# Altium project Generador de Funciones.PrjPcb
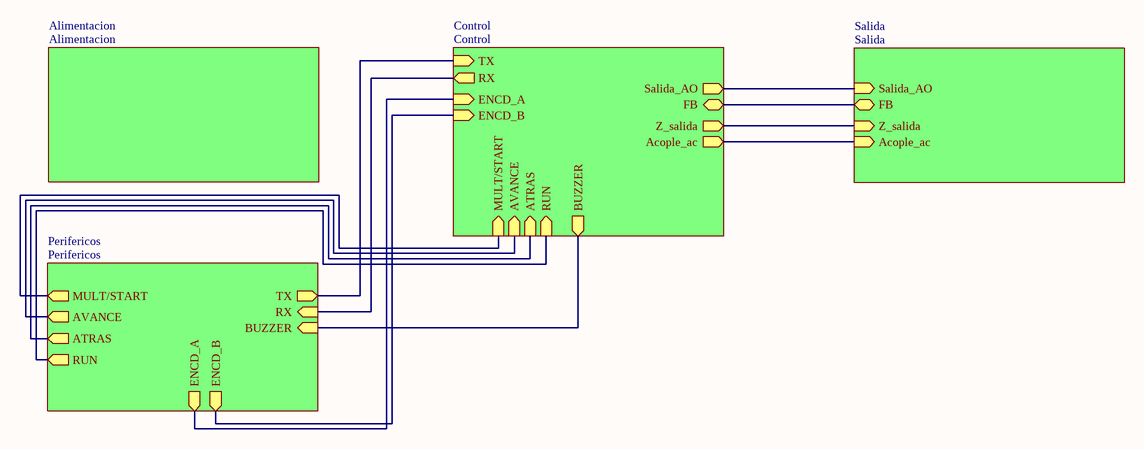
[diagram p0: main.SchDoc]
6 sheets, 107 parts. Net scope: hierarchical (ports join the sheet entries above them; power ports are global).
Board file: PCB_Awg.PcbDoc
Sheets:
  main.SchDoc
    Alimentacion = Alimentacion.SchDoc
    Control = Control.SchDoc
      Dac = 2-R2 Dac.SchDoc
    Salida = Salida.SchDoc
    Perifericos = Perifericos.SchDoc

## Sheet main.SchDoc: Generador de Funciones
size A4; Author: Zuliani, Agustin; Revision: v1.0; SheetNumber: 1; SheetTotal: 6

### Sub-sheets
Alimentacion = Alimentacion: no entries
Control = Control: TX (in), AVANCE (in), BUZZER (out), RUN (in), ENCD_B (in), MULT/START (in), Salida_AO (out), ATRAS (in), RX (out), Z_salida (out), Acople_ac (out), ENCD_A (in), FB (bidir)
Perifericos = Perifericos: BUZZER (in), ENCD_A (out), MULT/START (out), AVANCE (out), ATRAS (out), RUN (out), TX (out), RX (in), ENCD_B (out)
Salida = Salida: Salida_AO (in), Acople_ac (in), FB (bidir), Z_salida (in)

### Nets
ATRAS: sheet Control/ATRAS, sheet Perifericos/ATRAS
AVANCE: sheet Control/AVANCE, sheet Perifericos/AVANCE
MULT/START: sheet Control/MULT/START, sheet Perifericos/MULT/START
RUN: sheet Control/RUN, sheet Perifericos/RUN
RX: sheet Control/RX, sheet Perifericos/RX
TX: sheet Control/TX, sheet Perifericos/TX
NetC18_1: sheet Control/FB, sheet Salida/FB
NetP1_1: sheet Control/Salida_AO, sheet Salida/Salida_AO
NetP3_1: sheet Control/ENCD_A, sheet Perifericos/ENCD_A
NetP3_3: sheet Control/ENCD_B, sheet Perifericos/ENCD_B
NetR19_2: sheet Control/Acople_ac, sheet Salida/Acople_ac
NetR20_2: sheet Control/Z_salida, sheet Salida/Z_salida
NetR30_1: sheet Control/BUZZER, sheet Perifericos/BUZZER

## Sheet Alimentacion.SchDoc
size A3; SheetNumber: 2; SheetTotal: 6
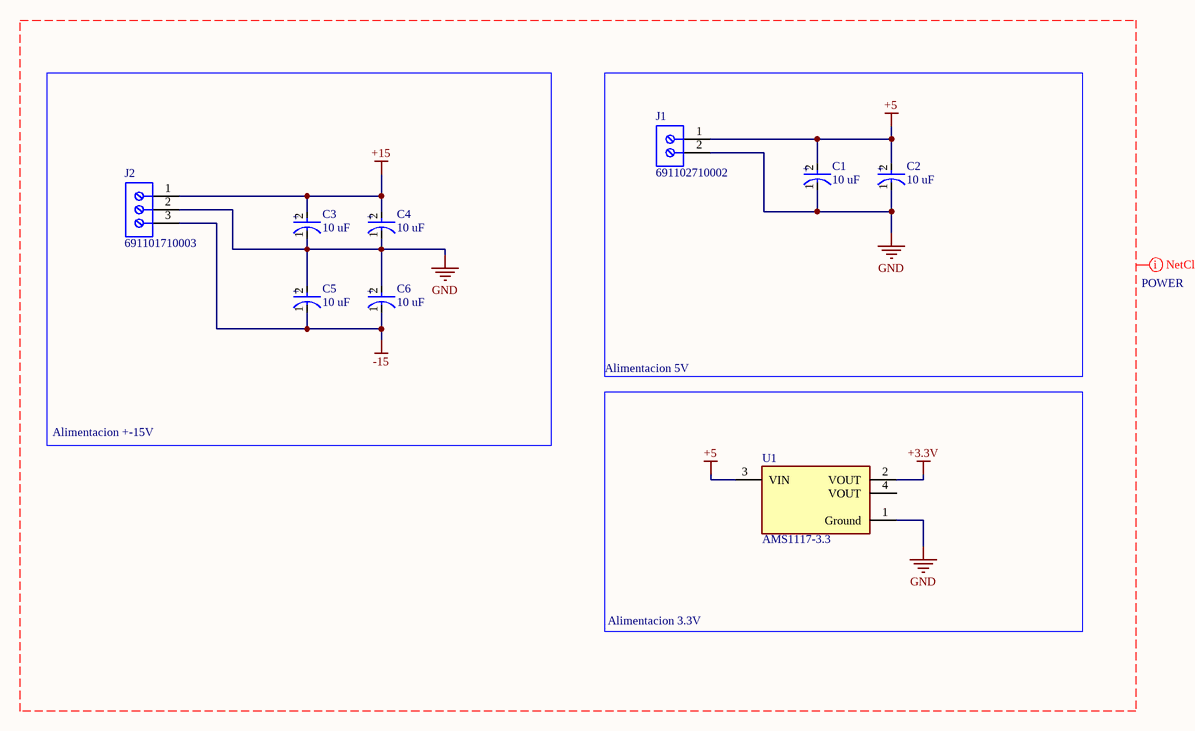
[diagram p1: Alimentacion.SchDoc]

### Parts
C1  10 uF  [FP-RAD-TH-D_5_0_5-L_11_1-MFG]
C2  10 uF  [FP-RAD-TH-D_5_0_5-L_11_1-MFG]
C3  10 uF  [FP-RAD-TH-D_5_0_5-L_11_1-MFG]
C4  10 uF  [FP-RAD-TH-D_5_0_5-L_11_1-MFG]
C5  10 uF  [FP-RAD-TH-D_5_0_5-L_11_1-MFG]
C6  10 uF  [FP-RAD-TH-D_5_0_5-L_11_1-MFG]
J1  691102710002  [691102710002]
J2  691101710003  [691101710003]
U1  AMS1117-3.3  [FP-AMS1117-IPC_C]

### Blocks framed on the sheet
Alimentacion +-15V: C3-C6 J2
Alimentacion 5V: C1 C2 J1

### Nets
+3.3V: U1.2(VOUT)
+5: C1.2(A) C2.2(A) J1.1 U1.3(VIN)
+15: C3.2(A) C4.2(A) J2.1
-15: C5.1(C) C6.1(C) J2.3
GND: C1.1(C) C2.1(C) C3.1(C) C4.1(C) C5.2(A) C6.2(A) J1.2 J2.2 U1.1(Ground)

Not connected (* = marked no-connect by the designer): U1 4(VOUT)

### Layout directives
net class POWER; rule Width Constraint [Pref Width = 0.5mm    Min Width = 0.5mm    Max Width = 1mm]: +3.3V, +5, +15, -15, GND

### Notes on the sheet
- Alimentacion 3.3V
- (in symbol CMP-05427-001517-1) +

### Library data of the parts
C1-C6 = CMP-05427-001517-1: Aluminum Electrolytic Capacitors (Radial Lead Type) 10uF ±20% 63V; Life (Hours): 2000Hour; Dielectric Material: Aluminium; Lead/Base Style: Straight; Ripple Current: 70mA; Dissipation Factor: 0.11%; Leakage Current: 3uA; Lead Diameter: 0.5mm; Max Operating Temperature: 85°C; Capacitance: 10uF; Voltage Rating: 63V; Packaging: Bulk; Radiation Hardening: No; Tolerance: 20%; Height: 11mm; Mount: Through Hole; Voltage: 63V; Voltage Rating (DC): 63V; Lead Pitch: 2mm; RoHS Compliant: Yes; Diameter: 5mm; Package Quantity: 200; Length: 11mm; Case/Package: Radial; Min Operating Temperature: -40°C; Construction: RADIAL; Height - Seated (Max): 0.472inch; Lead Free: Lead Free; Termination: Radial; Width: 5mm; Series: M; REACH SVHC: No SVHC
J1 = CMP-1502-03258-2: NexarPartId: 8917706; Number of Levels: 1; Number of Positions Per Level: 2; Current: 15A; Voltage: 300V; Pitch: 5.0038mm; Plating: Steel; Stripping Length: -6mm; Wire Gauge (Min): 14AWG; Wire Gauge (Max): 22AWG; Length: 7.5mm; Contact Material: Brass; Contact Plating: Tin; Packaging: Box; Number of Pins: 2; Voltage Rating: 300V; Termination: Screw; Number of Contacts: 2; Color: Blue; Current Rating: 15A; Mount: Through Hole; Max Operating Temperature: 105°C; Min Operating Temperature: -40°C; REACH SVHC: Unknown; Height: 13.4mm; Width: 11.2mm; Housing Material: Nylon; RoHS: Compliant; Wire/Cable Gauge: 22AWG; Lead Pitch: 5mm
J2 = CMP-1502-03257-2: NexarPartId: 8917705; Voltage Rating: 250V; Current: 16A; Wire Gauge (Min): 14AWG; Pitch: 5.0038mm; Wire Gauge (Max): 26AWG; Number of Positions Per Level: 3; Plating: Steel; Number of Levels: 1; Stripping Length: -7mm; REACH SVHC: Unknown; Width: 16.2mm; Height: 16.4mm; Contact Material: Brass; RoHS: Compliant; Color: Blue; Contact Plating: Tin; Lead Pitch: 5mm; Packaging: Box; Termination: Screw; Number of Contacts: 3; Wire/Cable Gauge: 26AWG; Min Operating Temperature: -40°C; Max Operating Temperature: 105°C; Housing Material: Nylon; Length: 9mm; Voltage: 250V; Mount: Through Hole; Current Rating: 16A; Number of Pins: 3
U1 = CMP-209535-000001-1: LDO Voltage Regulators 1A, 3.3V; Manufacturer: Advanced Monolithic Systems; Dropout Voltage: 1.1V; Output Type: Fixed; Nominal Supply Current: 5mA; Max Power Dissipation: 1.2W; Max Supply Voltage: 15V; Number Of Outputs: 1; Standoff Height: 0.64mm; Max Junction Temp: +125°C; Height: 1.8mm; Package: AMS1117; Device Class L2: Power Management ICs; ComponentLink2Description: Datasheet; ComponentLink2URL: http://www.advanced-monolithic.com/pdf/ds1117.pdf; Category: IC; RoHS: TRUE; Automotive: No; Device Class L1: Integrated Circuits (ICs); Output Current: 1A; Device Class L3: Voltage Regulators - Linear; Temperature: -40°C to +125°C; Output Voltage: 3.3V; Manufacturer Part Number: AMS1117-3.3; Temperature Range Low: -40°C; Octopart: https://octopart.com/ams1117-3.3-advanced+monolithic+systems-25899300; Lead Free: Yes; Ipc Land Pattern Name: SOT229P700X180-4; Temperature Range High: +125°C

## Sheet Control.SchDoc: Control
size A4; SheetNumber: 3; SheetTotal: 6
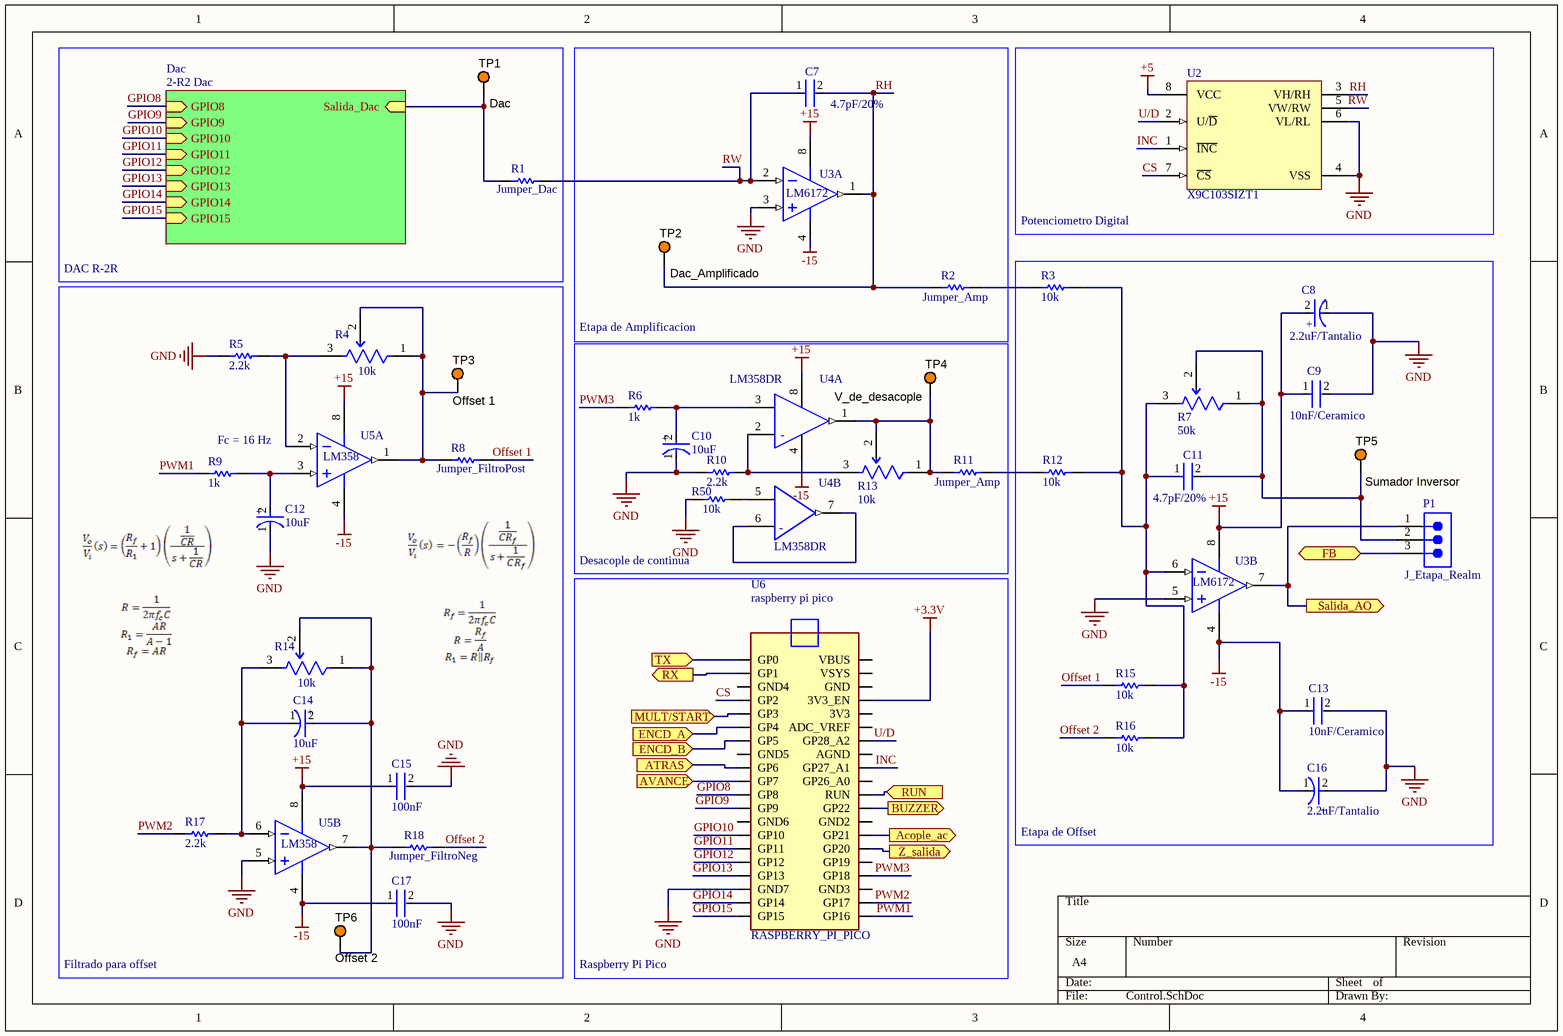
[diagram p2: Control.SchDoc]

### Parts
C7  4.7pF/20%  [FP-0805-L_2_01_0_2-W_1_25-IPC_B]
C8  2.2uF/Tantalio  [FP-T491A225K010AT-MFG]
C9  10nF/Ceramico  [FP-0805-L_2_01_0_2-W_1_25-IPC_B]
C10  10uF  [FP-RAD-TH-D_5_0_5-L_11_1-MFG]
C11  4.7pF/20%  [FP-0805-L_2_01_0_2-W_1_25-IPC_B]
C12  10uF  [FP-RAD-TH-D_5_0_5-L_11_1-MFG]
C13  10nF/Ceramico  [FP-0805-L_2_01_0_2-W_1_25-IPC_B]
C14  10uF  [FP-RAD-TH-D_5_0_5-L_11_1-MFG]
C15  100nF  [FP-0805-L_2_01_0_2-W_1_25-IPC_B]
C16  2.2uF/Tantalio  [FP-T491A225K010AT-MFG]
C17  100nF  [FP-0805-L_2_01_0_2-W_1_25-IPC_B]
P1  J_Etapa_Realm  [61300311121]
R1  Jumper_Dac  [RESC2013X50X30LL20T20]
R2  Jumper_Amp  [RESC2013X50X30LL20T20]
R3  10k  [RESC2013X50X30LL20T20]
R4  10k  [FP-3296W-MFG]
R5  2.2k  [RESC2013X50X30LL20T20]
R6  1k  [RESC2013X50X30LL20T20]
R7  50k  [FP-3296W-MFG]
R8  Jumper_FiltroPost  [RESC2013X50X30LL20T20]
R9  1k  [RESC2013X50X30LL20T20]
R10  2.2k  [RESC2013X50X30LL20T20]
R11  Jumper_Amp  [RESC2013X50X30LL20T20]
R12  10k  [RESC2013X50X30LL20T20]
R13  10k  [FP-3296W-MFG]
R14  10k  [FP-3296W-MFG]
R15  10k  [RESC2013X50X30LL20T20]
R16  10k  [RESC2013X50X30LL20T20]
R17  2.2k  [RESC2013X50X30LL20T20]
R18  Jumper_FiltroNeg  [RESC2013X50X30LL20T20]
R50  10k  [RESC2013X50X30LL20T20]
TP1  Dac  [KSTN-5003]
TP2  Dac_Amplificado  [KSTN-5003]
TP3  Offset 1  [KSTN-5003]
TP4  V_de_desacople  [KSTN-5003]
TP5  Sumador Inversor  [KSTN-5003]
TP6  Offset 2  [KSTN-5003]
U2  X9C103SIZT1  [M8_15_MFG]
U3  LM6172  [D0008A_N]  (parts A,B of 2)
U4  LM358DR  [FP-D0008A-MFG]  (parts A,B of 2)
U5  LM358  [ONSC-SOIC-8-751-07_V]  (parts A,B of 2)
U6  RASPBERRY_PI_PICO  [RASPBERRY_PI_PICO]

### Blocks framed on the sheet
DAC R-2R: R1 TP1
Etapa de Amplificacion: C7 R2 TP2 U3
Potenciometro Digital: U2
Etapa de Offset: C8 C9 C11 C13 C16 P1 R3 R7 R12 R15 R16 TP5 U3

### Sub-sheets
Dac = 2-R2 Dac: GPIO14 (in), GPIO9 (in), GPIO13 (in), GPIO8 (in), Salida_Dac (in), GPIO10 (in), GPIO11 (in), GPIO12 (in), GPIO15 (in)

### Ports
Acople_ac (out), ATRAS (in), AVANCE (in), BUZZER (out), ENCD_A (in), ENCD_B (in), FB (bidir), MULT/START (in), RUN (in), RX (out), Salida_AO (out), TX (in), Z_salida (out)

### Nets
+3.3V: U6.3V3_EN
+5: U2.8(VCC)
+15: C8.2(A) C9.1 C15.1 U3.8(V+) U4.8(V+) U5.8(VCC)
-15: C13.1 C16.1(C) C17.1 U3.4(V-) U4.4(V-) U5.4(VEE/GND)
GND: C8.1(C) C9.2 C10.1(C) C12.1(C) C13.2 C15.2 C16.2(A) C17.2 R5.1 R10.1 R50.1 U2.4(VSS) U2.6(VL/RL) U3.3(INA+) U3.5(INB+) U5.5(INB+) U6.GND7
ATRAS: U6.GP6 ; port ATRAS
AVANCE: U6.GP7 ; port AVANCE
CS: U2.7(~{CS}) U6.GP2
GPIO8: U6.GP8 ; sheet Dac/GPIO8
GPIO9: U6.GP9 ; sheet Dac/GPIO9
GPIO10: U6.GP10 ; sheet Dac/GPIO10
GPIO11: U6.GP11 ; sheet Dac/GPIO11
GPIO12: U6.GP12 ; sheet Dac/GPIO12
GPIO13: U6.GP13 ; sheet Dac/GPIO13
GPIO14: U6.GP14 ; sheet Dac/GPIO14
GPIO15: U6.GP15 ; sheet Dac/GPIO15
INC: U2.1(~{INC}) U6.GP27_A1
MULT/START: U6.GP3 ; port MULT/START
Offset 1: R8.2 R15.1
Offset 2: R16.1 R18.2
PWM1: R9.1 U6.GP16
PWM2: R17.1 U6.GP17
PWM3: R6.1 U6.GP18
RH: C7.2 R2.1 TP2.1 U2.3(VH/RH) U3.1(OUTA)
RUN: U6.RUN ; port RUN
RW: C7.1 R1.2 U2.5(VW/RW) U3.2(INA-)
RX: U6.GP1 ; port RX
Salida_Dac: R1.1 TP1.1 ; sheet Dac/Salida_Dac
TX: U6.GP0 ; port TX
U/D: U2.2(U/~{D}) U6.GP28_A2
NetC10_2: C10.2(A) R6.2 U4.3(IN1+)
NetC11_1: C11.1 R3.2 R7.3(CW) R12.2 R15.2 R16.2 U3.6(INB-)
NetC11_2: C11.2 P1.2 R7.1(CCW) R7.2(WIPER) TP5.1
NetC12_2: C12.2(A) R9.2 U5.3(INA+)
NetC14_1: C14.1(C) R14.3(CW) R17.2 U5.6(INB-)
NetC14_2: C14.2(A) R14.1(CCW) R14.2(WIPER) R18.1 TP6.1 U5.7(OUTB)
NetC18_1: P1.3 ; port FB
NetP1_1: P1.1 U3.7(OUTB) ; port Salida_AO
NetP3_1: U6.GP4 ; port ENCD_A
NetP3_3: U6.GP5 ; port ENCD_B
NetR2_2: R2.2 R3.1
NetR4_1: R4.1(CCW) R4.2(WIPER) R8.1 TP3.1 U5.1(OUTA)
NetR4_3: R4.3(CW) R5.2 U5.2(INA-)
NetR10_2: R10.2 R13.3(CW) U4.2(IN1-)
NetR11_1: R11.1 R13.1(CCW) R13.2(WIPER) TP4.1 U4.1(1OUT)
NetR11_2: R11.2 R12.1
NetR19_2: U6.GP21 ; port Acople_ac
NetR20_2: U6.GP20 ; port Z_salida
NetR30_1: U6.GP22 ; port BUZZER
NetR50_2: R50.2 U4.5(IN2+)
NetU4_6: U4.6(IN2-) U4.7(2OUT)

Not connected (* = marked no-connect by the designer): U6 3V3 ADC_VREF AGND GND GND2 GND3 GND4 GND5 GND6 GP19 GP26_A0 VBUS VSYS

### Notes on the sheet
- Fc = 16 Hz
- Desacople de continua
- Filtrado para offset
- Raspberry Pi Pico
- (in symbol CMP-1685-00009-2, part A) -
- (in symbol CMP-1685-00009-2, part B) -
- (in symbol CMP-03017-000061-1) +
- (in symbol CMP-05427-001517-1) +
- (in symbol RASPBERRY_PI_PICO) raspberry pi pico

### Library data of the parts
C7 C9 C11 C13 C15 C17 = CMP-2007-04174-2: General Purpose Ceramic Capacitor, 0805, 100nF, 10%, X7R, 15%, 100V; Packaging: Tape and Reel; Min Operating Temperature: -55°C; Dielectric Material: Ceramic; Height: 1.4mm; Voltage Rating: 100V; Termination: SMD/SMT; Case Code (Imperial): 0805; Case Code (Metric): 2012; Case/Package: 0805; Construction: Flat; Radiation Hardening: No; Series: -; Dielectric: X7R; Package Quantity: 2000; Mount: Surface Mount; Capacitance: 100nF; Contact Plating: Tin; Voltage: 100V; Lead Free: Lead Free; Depth: 1.25mm; RoHS Compliant: Yes; Number of Pins: 2; Max Operating Temperature: 125°C; Length: 2.01mm; Voltage Rating (DC): 100V; Thickness: 0.055inch; REACH SVHC: No SVHC; Width: 0.049inch; Tolerance: 10%
C8 C16 = CMP-03017-000061-1: CAP TANT 2.2UF 10% 10V 1206; Polarity: Polar; Dissipation Factor: 6%; ESR (Equivalent Series Resistance): 8R; Ripple Current: 97mA; Dielectric Material: Tantalum; Life (Hours): 2000Hour; Leakage Current: 500nA; Max Operating Temperature: 125°C; Length: 3.2mm; Tolerance: 10%; RoHS Compliant: Yes; Packaging: Tape and Reel; Package Quantity: 1; Voltage: 10V; Voltage Rating: 10V; Height - Seated (Max): 0.071inch; Width: 1.6mm; Voltage Rating (DC): 10V; REACH SVHC: No SVHC; Lead Free: Lead Free; Features: General Purpose; Termination: SMD/SMT; Height: 1.6mm; Depth: 1.6mm; Min Operating Temperature: -55°C; Radiation Hardening: No; Mount: Surface Mount; Capacitance: 2.2uF; Case Code (Metric): 3216; Case/Package: 1206; Case Code (Imperial): 1206; Number of Pins: 2
C10 C12 C14 = CMP-05427-001517-1: as C1 on sheet Alimentacion; Max Operating Temperature: 85°C; Capacitance: 10uF; Voltage Rating: 63V; Packaging: Bulk; Radiation Hardening: No; Tolerance: 20%; Height: 11mm; Mount: Through Hole; Voltage: 63V; Voltage Rating (DC): 63V; Lead Pitch: 2mm; RoHS Compliant: Yes; Diameter: 5mm; Package Quantity: 200; Length: 11mm; Case/Package: Radial; Min Operating Temperature: -40°C; Construction: RADIAL; Height - Seated (Max): 0.472inch; Lead Free: Lead Free; Termination: Radial; Width: 5mm; Series: M; REACH SVHC: No SVHC
P1 = CMP-1502-01062-3: NexarPartId: 32855521; Current Rating: 3A; Voltage Rating: 250V; Number of Positions: 3; Pitch: 2.54mm; Contact Resistance: 20mΩ; Connector Type: Male Pin; Gender: Male; REACH SVHC: Unknown; Packaging: Bulk; Contact Material: Copper; Min Operating Temperature: -40°C; Number of Rows: 1; Orientation: Vertical; RoHS: Compliant; Contact Plating: Gold; Max Operating Temperature: 105°C; Mount: Through Hole; Height: 8.94mm; Operating Supply Voltage: 250V; Number of Pins: 3; Contact Mating Length: 5.9944mm; Number of Contacts: 3; Color: Black; Lead Free: Lead Free; Lead Pitch: 2.54mm; Termination: Solder
R1-R3 R5 R6 R8-R12 R15-R18 R50 = CMP-2001-04896-1: Manufacturer: Vishay Dale; Part Number: CRCW08050000Z0EA
R4 R7 R13 R14 = CMP-07234-000046-1: TRIMMER 500 OHM 0.5W PC PIN TOP; Resistance: 500R; Temperature Coefficient: 100ppm/°C; Resistance Tolerance: 10%; Number of Turns: 25; Max Power Dissipation: 500mW; Packaging: Rail/Tube; Color: Blue; Technology: CERMET; Max Operating Temperature: 125°C; RoHS Compliant: Yes; Radiation Hardening: No; Series: 3296; Military Standard: Not; Width: 9.53mm; Weight: 0.03oz; Length: 9.53mm; Package Quantity: 50; Height: 0.395inch; Min Operating Temperature: -55°C; Lead Free: Lead Free; Mount: Through Hole; Depth: 4.83mm; Termination: Pin; Taper: Linear; Contact Plating: Tin; Resistor Type: Cermet; Tolerance: 10%; REACH SVHC: No SVHC; Power Rating: 500mW
TP1-TP6 = CMP-1672-00009-1: Test Point, Orange, 1-Pin THD, RoHS; Peak Reverse Current: 600 uA; Forward Current: 3 A; Max Surge Current: 80 A; Forward Voltage: 1.08 V; Max Operating Temperature: 150 degC; PackageReference: 5003; Pins: 2; ComponentLink2URL: http://keyelco.com/userAssets/file/M65p56.pdf; PackageDescription: 1-Pin Through Hole Device, Dia 2.54 mm; Weight: 0.01 lb; Diameter: 5.3 mm; Mount: Through Hole; Package Quantity: 500; Packaging: Bulk; Min Operating Temperature: -65 degC; ComponentLink1Description: Manufacturer URL; Height: 0.25 inch; ComponentLink1URL: http://www.keyelco.com/; ComponentLink2Description: Datasheet; Width: 0.25 inch; REACH SVHC: No SVHC; RoHSCompliant: true; Radiation Hardening: No; Length: 9.5 mm; DatasheetVersion: Jun-15
U2 = CMP-00572-88253303-1: X9C103 Series 100 Tap Non Volatile 10 kOhm Digital Potentiometer - SOIC-8; Manufacturer Lifecycle Status: ACTIVE; Max Supply Current: 1mA; Resistance: 10kΩ; Operating Supply Voltage: 5V; Number of Circuits: 1; Min Supply Voltage: 4.5V; Tolerance: 20%; Pitch: 1.3mm; Interface: SPI; Memory Type: Non-Volatile; Number of Taps: 100; Max Supply Voltage: 5.5V; Temperature Coefficient: 300ppm/°C; Radiation Hardening: No; Contact Plating: Tin; ComponentLink1URL: http://www.renesas.com; Operating Supply Current: 1mA; Lead Free: Lead Free; Number of Pins: 8; Height: 0m; RoHS: Compliant; Min Input Voltage: 4.5V; Mount: Surface Mount; ComponentLink2URL: https://octopart.com/cad-content/api/get-model-datasheet/15189/88253303; ComponentLink3URL: https://www.renesas.com/en/document/psc/m815-8-lead-narrow-body-small-outline-plastic-package; Max Operating Temperature: 85°C; ComponentLink2Description: Datasheet URL; Width: 3.9mm; Length: 4.9mm; Taper: Linear; HelpURL: https://octopart.com/cad-content/api/get-model-datasheet/15189/88253303; Number of Positions: 100; Min Operating Temperature: -40°C; ComponentLink1Description: Manufacturer's Website; Max Input Voltage: 5.5V; Case/Package: SOIC; ComponentLink3Description: Manufacturer's Package Drawing; Lifecycle Status: Production
U3 = CMP-0055-00806-3: Dual High Speed, Low Power, Low Distortion Voltage Feedback Amplifiers, 8-pin Narrow SOIC, Pb-Free; Manufacturer: Texas Instruments; PackageTopMarking: NSZXTT*LM61*72IM; PowerWise: Y; Code_IPC: SOIC127P600-8; ComponentLink1Description: Datasheet URL; CompType: Amplifiers; Package Reference: D0008A; RoHS: Y; PinCount: 8; ComponentLink1URL: http://www.ti.com/general/docs/lit/getliterature.tsp?genericPartNumber=LM6172&fileType=pdf; PackageDescription: SOIC Narrow, 4.9 x 3.9 x 1.45mm, 8 Lead, 1.27mm Pitch; Code_JEDEC: MS-012-AA
U4 = CMP-1685-00009-2: IC OPAMP GP 2 CIRCUIT 8SOIC; Output Current: 30mA; Min Dual Supply Voltage: 1.5V; Input Offset Voltage (Vos): 7mV; Power Supply Rejection Ratio (PSRR): 65dB; Unity Gain Bandwidth Product: 700kHz; Number of Channels: 2; Min Supply Voltage: 3V; Max Dual Supply Voltage: 16V; Dual Supply Voltage: 9V; Max Supply Voltage: 32V; Nominal Supply Current: 1.2mA; Slew Rate: 0.3V/µs; Input Bias Current: 250nA; Voltage Gain: 100dB; Operating Supply Current: 1mA; REACH SVHC: No SVHC; Package Quantity: 2500; Width: 3.91mm; Max Operating Temperature: 70°C; Min Operating Temperature: 0°C; Mount: Surface Mount; Length: 4.9mm; Radiation Hardening: No; Case/Package: SOIC; Lead Free: Lead Free; Number of Elements: 2; Packaging: Tape and Reel; Output Current per Channel: 30mA; Number of Circuits: 2; Bandwidth: 700kHz; Operating Supply Voltage: 16V; Gain Bandwidth Product: 700kHz; Number of Pins: 8; Number of Amplifiers: 2; Height: 1.58mm; Common Mode Rejection Ratio: 65dB; Contact Plating: Gold
U5 = CMP-1310-00289-1: Single Supply Dual Operational Amplifier, 3 to 32 V, 0 to 70 degC, 8-Pin SOIC, Pb-Free, Tape and Reel; Manufacturer: On Semiconductor; PartNumber: LM358ADR2G; VCC Min (V): 3; VCC Max (V): 32; DatasheetVersion: Rev. 27; ComponentLink1URL: http://www.onsemi.com/; PackageVersion: Rev. AK, 02/2011; Packing: Tape and Reel; ComponentLink3URL: http://www.onsemi.com/pub_link/Collateral/751-07.PDF; ComponentLink2URL: http://www.onsemi.cn/pub_link/Collateral/LM358-D.PDF; Mounting Technology: Surface Mount; PackageReference: SOIC-8-751-07; PackageDescription: 8-Pin Small Outline Integrated Circuit, Body 4.9 x 3.9 mm, Pitch 1.27 mm; ComponentLink3Description: Package Specification; ComponentLink2Description: Datasheet; RoHS: TRUE; ComponentLink1Description: Manufacturer URL
U6 = RASPBERRY_PI_PICO: Raspberry Pi Board, Arm Cortex-M0+; Core Architecture:Arm; Core Sub-Architecture:Cortex-M0+; Kit Contents:Raspberry Pi Pico Board; No. Of Bits:32Bit; Silicon Core Number:Rp2040; Silicon Manufacturer:Raspberry Pi |Raspberry-Pi RASPBERRY PI PICO; SnapEDA_Link: https://www.snapeda.com/parts/RASPBERRY%20PI%20PICO/Raspberry+Pi/view-part/?ref=snap; Package: None; Value: *; MF: Raspberry Pi; MP: RASPBERRY PI PICO; Check_prices: https://www.snapeda.com/parts/RASPBERRY%20PI%20PICO/Raspberry+Pi/view-part/?ref=eda

## Sheet 2-R2 Dac.SchDoc
size A4; SheetNumber: 4; SheetTotal: 6
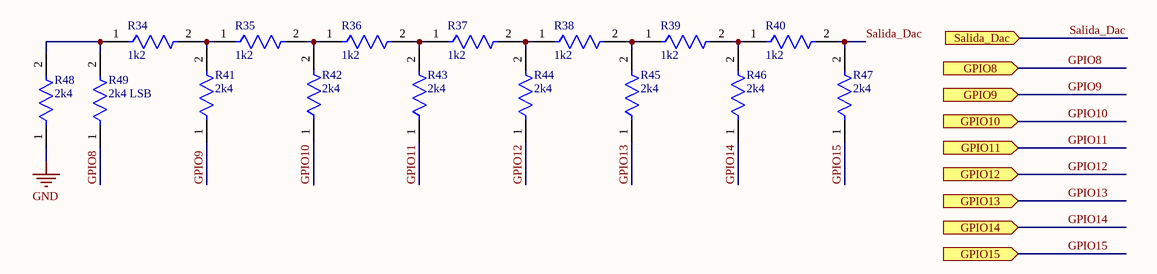
[diagram p3: 2-R2 Dac.SchDoc]

### Parts
R34  1k2  [FP-MFR-25-MFG]
R35  1k2  [FP-MFR-25-MFG]
R36  1k2  [FP-MFR-25-MFG]
R37  1k2  [FP-MFR-25-MFG]
R38  1k2  [FP-MFR-25-MFG]
R39  1k2  [FP-MFR-25-MFG]
R40  1k2  [FP-MFR-25-MFG]
R41  2k4  [FP-MFR-25-MFG]
R42  2k4  [FP-MFR-25-MFG]
R43  2k4  [FP-MFR-25-MFG]
R44  2k4  [FP-MFR-25-MFG]
R45  2k4  [FP-MFR-25-MFG]
R46  2k4  [FP-MFR-25-MFG]
R47  2k4  [FP-MFR-25-MFG]
R48  2k4  [FP-MFR-25-MFG]
R49  2k4 LSB  [FP-MFR-25-MFG]

### Ports
GPIO8 (in), GPIO9 (in), GPIO10 (in), GPIO11 (in), GPIO12 (in), GPIO13 (in), GPIO14 (in), GPIO15 (in), Salida_Dac (in)

### Nets
GND: R48.1
GPIO8: R49.1 ; port GPIO8
GPIO9: R41.1 ; port GPIO9
GPIO10: R42.1 ; port GPIO10
GPIO11: R43.1 ; port GPIO11
GPIO12: R44.1 ; port GPIO12
GPIO13: R45.1 ; port GPIO13
GPIO14: R46.1 ; port GPIO14
GPIO15: R47.1 ; port GPIO15
Salida_Dac: R40.2 R47.2 ; port Salida_Dac
NetR34_1: R34.1 R48.2 R49.2
NetR34_2: R34.2 R35.1 R41.2
NetR35_2: R35.2 R36.1 R42.2
NetR36_2: R36.2 R37.1 R43.2
NetR37_2: R37.2 R38.1 R44.2
NetR38_2: R38.2 R39.1 R45.2
NetR39_2: R39.2 R40.1 R46.2

### Library data of the parts
R34-R49 = CMP-03413-000001-1: RES 1.18K OHM 1/4W 1% AXIAL; Manufacturer: Yageo; Manufacturer Part Number: MFR-25FBF52-1K18; Value: 1.18kΩ; Description: 1.18 kOhms ±1% 0.25W, 1/4W Through Hole Resistor Axial  Metal Film; Temperature Coefficient: 100ppm/°C; Power Rating: 0.25W; Voltage Rating: 250V; Temperature: -55°C to +155°C; Automotive: No; Temperature Range High: +155°C; Mouser Description: Metal Film Resistors 1.18K OHM 1/4W 1%; Digikey Description: RES 1.18K OHM 1/4W 1% AXIAL; Lead Free: Yes; Tolerance: 1%; ComponentLink2Description: Datasheet; ComponentLink2URL: https://www.yageo.com/upload/media/product/products/datasheet/lr/Yageo_LR_MFR_1.pdf; Temperature Range Low: -55°C; Package: MFR-25; Ipc Land Pattern Name: RESAD1000W75L680D260; Composition: Metal Film; Category: Res; Octopart: https://octopart.com/mfr-25fbf52-1k18-yageo-56251681; Series: MFR; Device Class L2: Resistors; Height: 2.6mm; Resistance: 1.18kΩ; Device Class L3: Through-Hole Resistors; RoHS: TRUE; Device Class L1: Passive Components

## Sheet Salida.SchDoc
size A3; SheetNumber: 5; SheetTotal: 6
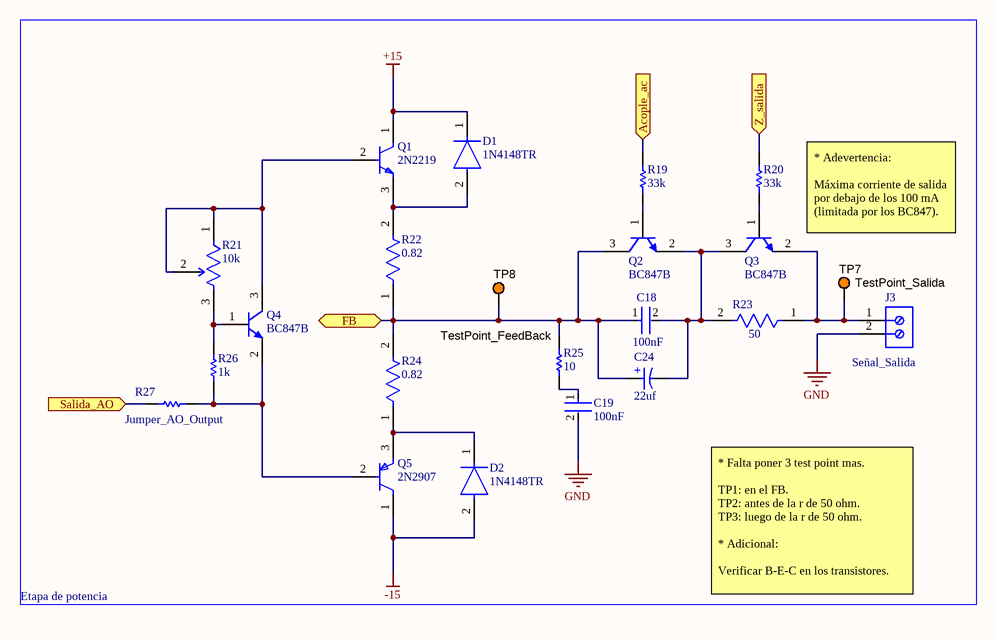
[diagram p4: Salida.SchDoc]

### Parts
C18  100nF  [FP-0805-L_2_01_0_2-W_1_25-IPC_B]
C19  100nF  [FP-0805-L_2_01_0_2-W_1_25-IPC_B]
C24  22uf  [WCAP-ASLU_D4H5.5]
D1  1N4148TR  [FP-6_560-5004_12-4-MFG]
D2  1N4148TR  [FP-6_560-5004_12-4-MFG]
J3  Señal_Salida  [691102710002]
Q1  2N2219  [FP-135AR-MFG]
Q2  BC847B  [INF-SOT23_L]
Q3  BC847B  [INF-SOT23_L]
Q4  BC847B  [INF-SOT23_L]
Q5  2N2907  [FP-135AR-MFG]
R19  33k  [RESC2013X60X35ML10T20]
R20  33k  [RESC2013X60X35ML10T20]
R21  10k  [FP-3296W-MFG]
R22  0.82  [FP-RLR07-MFG]
R23  50  [FP-RLR07-MFG]
R24  0.82  [FP-RLR07-MFG]
R25  10  [RESC2013X60X35ML10T20]
R26  1k  [RESC2013X60X35ML10T20]
R27  Jumper_AO_Output  [RESC2013X50X30LL20T20]
TP7  TestPoint_Salida  [KSTN-5003]
TP8  TestPoint_FeedBack  [KSTN-5003]

### Blocks framed on the sheet
Etapa de potencia: C18 C19 C24 D1 D2 J3 Q1-Q5 R19-R27 TP7 TP8

### Ports
Acople_ac (in), FB (bidir), Salida_AO (in), Z_salida (in)

### Nets
+15: D1.1(C) Q1.1(C)
-15: D2.2(A) Q5.1(C)
GND: C19.2 J3.2
NetC18_1: C18.1 C24.1(P) Q2.3(C) R22.1 R24.2 R25.2 TP8.1 ; port FB
NetC18_2: C18.2 C24.2(N) Q2.2(E) Q3.3(C) R23.2
NetC19_1: C19.1 R25.1
NetD1_2: D1.2(A) Q1.3(E) R22.2
NetD2_1: D2.1(C) Q5.3(E) R24.1
NetJ3_1: J3.1 Q3.2(E) R23.1 TP7.1
NetP1_1: R27.1 ; port Salida_AO
NetQ1_2: Q1.2(B) Q4.3(C) R21.1(CCW) R21.2(WIPER)
NetQ2_1: Q2.1(B) R19.1
NetQ3_1: Q3.1(B) R20.1
NetQ4_1: Q4.1(B) R21.3(CW) R26.2
NetQ4_2: Q4.2(E) Q5.2(B) R26.1 R27.2
NetR19_2: R19.2 ; port Acople_ac
NetR20_2: R20.2 ; port Z_salida

### Notes on the sheet
- * Adevertencia:
  Máxima corriente de salida por debajo de los 100 mA (limitada por los BC847).
- * Falta poner 3 test point mas.
  TP1: en el FB.
  TP2: antes de la r de 50 ohm.
  TP3: luego de la r de 50 ohm.
  * Adicional:
  Verificar B-E-C en los transistores.
- (in symbol CMP-03913-53914652-1) +

### Library data of the parts
C18 C19 = CMP-2007-04174-2: as C7 on sheet Control; Packaging: Tape and Reel; Min Operating Temperature: -55°C; Dielectric Material: Ceramic; Height: 1.4mm; Voltage Rating: 100V; Termination: SMD/SMT; Case Code (Imperial): 0805; Case Code (Metric): 2012; Case/Package: 0805; Construction: Flat; Radiation Hardening: No; Series: -; Dielectric: X7R; Package Quantity: 2000; Mount: Surface Mount; Capacitance: 100nF; Contact Plating: Tin; Voltage: 100V; Lead Free: Lead Free; Depth: 1.25mm; RoHS Compliant: Yes; Number of Pins: 2; Max Operating Temperature: 125°C; Length: 2.01mm; Voltage Rating (DC): 100V; Thickness: 0.055inch; REACH SVHC: No SVHC; Width: 0.049inch; Tolerance: 10%
C24 = CMP-03913-53914652-1: 865090640004 WCAP-ASLU Aluminum Electrolytic Capacitors; Capacitance: 470nF; Tolerance: 20%; Voltage Rating: 50V; Material: Aluminium; Life (Hours): 1000hours; Ripple Current: 4mA; Insulation Resistance: 16.6667MΩ; Leakage Current: 400nA; Polarity: Polar; Packaging: Tape & Reel (TR); Max Operating Temperature: 85°C; Min Operating Temperature: -40°C; Height - Seated (Max): 5.5118mm; Diameter: 4mm; Length: 5.5mm; Ripple Current (AC): 4mA; Width: 4.3mm; RoHS: Compliant; Case/Package: Radial; Mount: Surface Mount; REACH SVHC: Unknown; Height: 5.5mm; Voltage Rating (DC): 50V; NexarPartId: 53914652
D1 D2 = CMP-02540-000029-2: DIODE GEN PURP 75V 300MA DO35; Element Configuration: Single; Power Dissipation: 440mW; Reverse Recovery Time: 8ns; Peak Non-Repetitive Surge Current: 2A; Max Repetitive Reverse Voltage (Vrrm): 100V; Forward Voltage: 1V; Current Rating: 150A; Number of Pins: 2; Packaging: Tape and Reel; Mount: Through Hole; Forward Current: 300mA; Lead Free: Lead Free; Max Operating Temperature: 175°C; Min Operating Temperature: -65°C
J3 = CMP-1502-03258-2: as J1 on sheet Alimentacion; Length: 7.5mm; Contact Material: Brass; Contact Plating: Tin; Packaging: Box; Number of Pins: 2; Voltage Rating: 300V; Termination: Screw; Number of Contacts: 2; Color: Blue; Current Rating: 15A; Mount: Through Hole; Max Operating Temperature: 105°C; Min Operating Temperature: -40°C; REACH SVHC: Unknown; Height: 13.4mm; Width: 11.2mm; Housing Material: Nylon; RoHS: Compliant; Wire/Cable Gauge: 22AWG; Lead Pitch: 5mm
Q1 = CMP-00278-84324566-1: BC548CTA Small Signal Bipolar Transistor, 0.1A I(C), 30V V(BR)CEO, 1-Element, NPN, Silicon, TO-92; Manufacturer Lifecycle Status: ACTIVE; Max Power Dissipation: 500mW; Max Collector Current: 100mA; Max Junction Temperature (Tj): 150°C; Transition Frequency: 300MHz; Emitter Base Voltage (VEBO): 5V; hFE Min: 110; Element Configuration: Single; Collector Emitter Saturation Voltage: 250mV; Number of Elements: 1; Height: 4.58mm; Width: 3.86mm; Collector Emitter Voltage (VCEO): 30V; Schedule B: 8541210080, 8541210080; Max Operating Temperature: 150°C; REACH SVHC: No SVHC; Number of Pins: 3; Power Dissipation: 500mW; Frequency: 300MHz; Polarity: NPN; Lead Free: Lead Free; Voltage Rating (DC): 30V; Weight: 240mg; Max Breakdown Voltage: 30V; Current Rating: 100mA; NexarPartId: 84324566; Min Operating Temperature: -65°C; Collector Emitter Breakdown Voltage: 30V; Gain Bandwidth Product: 300MHz; Radiation Hardening: No; Collector Base Voltage (VCBO): 30V; RoHS: Compliant; Contact Plating: Tin; Length: 4.58mm; Lifecycle Status: Production; Case/Package: TO-92; Mount: Through Hole; Max Frequency: 300MHz
Q2-Q4 = CMP-1177-00042-1: NPN Silicon AF Transistor, 45 V VCEO, 100 mA IC, SOT23, Reel, Green; Manufacturer: Infineon; VEBO (max): 6Â V; ICBO (max): 15Â nA; VCBO (max): 50Â V; IBM (max): 200Â mA; Green: TRUE; Ptot (max): 330Â mW; fT (typ): 250Â MHz; IC (max): 100Â mA; VCEO (max): 45Â V; PackageDescription: 3-Pin Small Outline Transistor Package, 1.3 x 2.9 mm Body, 0.95 mm Pitch; ComponentLink3URL: http://www.infineon.com/dgdl/SOT23-Package_Overview.pdf?folderId=db3a30431936bc4b0119532290053c66&fileId=db3a30431936bc4b0119533468123c85; PackageVersion: Apr-08; Packing: Reel; ComponentLink3Description: Package Specification; ComponentLink2URL: http://www.infineon.com/dgdl/bc847series_bc848series_bc849series_bc850series.pdf?folderId=db3a304314dca389011541d30fa21656&fileId=db3a304314dca389011541d4630a1657; ComponentLink1URL: http://www.infineon.com/; ComponentLink2Description: Datasheet; Polarity: NPN; Mounting Technology: Surface Mount; PackageReference: SOT23; ICM (max): 200Â mA; ComponentLink1Description: Manufacturer URL; PartNumber: BC847B
Q5 = CMP-00278-84408945-1: BC557BTF Small Signal Bipolar Transistor, 0.1A I(C), 45V V(BR)CEO, 1-Element, PNP, Silicon, TO-92; Manufacturer Lifecycle Status: ACTIVE; Max Power Dissipation: 500mW; Frequency: 150MHz; hFE Min: 110; Number of Elements: 1; Current Rating: -100mA; Collector Emitter Saturation Voltage: -250mV; Max Collector Current: 100mA; Emitter Base Voltage (VEBO): -5V; Voltage Rating (DC): -45V; Element Configuration: Single; Max Frequency: 10MHz; Collector Base Voltage (VCBO): -50V; Collector Emitter Voltage (VCEO): 45V; Contact Plating: Tin; Min Operating Temperature: -65°C; RoHS: Compliant; Max Operating Temperature: 150°C; Weight: 240mg; Power Dissipation: 500mW; Lifecycle Status: Production; Case/Package: TO-92; Collector Emitter Breakdown Voltage: 45V; Length: 5.2mm; Schedule B: 8541210080, 8541210080; Lead Free: Lead Free; Polarity: PNP; REACH SVHC: No SVHC; Mount: Through Hole; NexarPartId: 84408945; Max Breakdown Voltage: 45V; Transition Frequency: 150MHz; Height: 5.33mm; Number of Pins: 3; Gain Bandwidth Product: 150MHz; Width: 4.19mm
R19 R20 R25 R26 = CMP-2100-03671-1: Chip Resistor, 1 KOhm, +/- 1%, 125 mW, -55 to 155 degC, 0805 (2012 Metric), RoHS, Tape and Reel; Manufacturer: Yageo; Temperature Coefficient: 100ppm/degreesC; Voltage Rating (DC): 150V; Max Power Dissipation: 125mW; Resistance: 1KOhm; Number of Pins: 2; Number of Terminations: 2; Datasheet URL: http://www.yageo.com/NewPortal/yageodocoutput?fileName=/pdf/R-Chip/PYu-RC_Group_51_RoHS_L_5.pdf; Length: 0.079inch; Package Description: 2-Pin Surface Mounted Device, Body 2 x 1.25 mm; Depth: 1.25mm; Height: 0.024inch; Military Standard: Not; Case/Package: 0805; Package Reference: 0805; RoHSCompliant: true; Lead Free: LeadFree; Packaging: TapeandReel; Package Quantity: 1; Datasheet Version: Rev. 5, 10/2016; Tolerance: 1%; Min Operating Temperature: -55degC; Voltage Rating: 150V; Composition: ThickFilm; Case Code (Imperial): 0805; Power Rating: 125mW; Width: 0.049inch; Case Code (Metric): 2012; Manufacturer URL: http://www.yageo.com/; Max Operating Temperature: 155degC; REACH SVHC: Unknown; Termination: SMD/SMT
R21 = CMP-07234-000046-1: as R4 on sheet Control; Packaging: Rail/Tube; Color: Blue; Technology: CERMET; Max Operating Temperature: 125°C; RoHS Compliant: Yes; Radiation Hardening: No; Series: 3296; Military Standard: Not; Width: 9.53mm; Weight: 0.03oz; Length: 9.53mm; Package Quantity: 50; Height: 0.395inch; Min Operating Temperature: -55°C; Lead Free: Lead Free; Mount: Through Hole; Depth: 4.83mm; Termination: Pin; Taper: Linear; Contact Plating: Tin; Resistor Type: Cermet; Tolerance: 10%; REACH SVHC: No SVHC; Power Rating: 500mW
R22-R24 = CMP-00030-39447724-1: RLR07C1001FSB14 Fixed Resistor, Metal Film, 0.25W, 1000ohm, 250V, 1% +/-Tol, 100ppm/Cel, Through Hole Mount; Wire/Cable Diameter: 50.8µm; Lead Diameter: 640µm; Max Power Dissipation: 250mW; Temperature Coefficient: 100ppm/°C; Resistance: 1kΩ; Lead Length: 38.1mm; Voltage Rating: 250V; Lead Free: Contains Lead; REACH SVHC: Unknown; Packaging: Bulk; Military Standard: MIL-PRF-39017; Width: 2.29mm; Max Operating Temperature: 150°C; Length: 7.62mm; Min Operating Temperature: -65°C; Composition: Metal Film; Diameter: 2.29mm; Radiation Hardening: No; Features: Military, Moisture Resistant, Weldable; Failure Rate: 0.001%; Case/Package: Conformal; Tolerance: 1%; Voltage Rating (DC): 250V; Schedule B: 8533210090, 8533210090; RoHS: Non-Compliant; Termination: Axial; Power Rating: 250mW; Contact Plating: Lead, Tin; NexarPartId: 39447724; Number of Terminations: 2; Number of Pins: 14
R27 = CMP-2001-04896-1: as R1 on sheet Control
TP7 TP8 = CMP-1672-00009-1: as TP1 on sheet Control; Max Operating Temperature: 150 degC; PackageReference: 5003; Pins: 2; ComponentLink2URL: http://keyelco.com/userAssets/file/M65p56.pdf; PackageDescription: 1-Pin Through Hole Device, Dia 2.54 mm; Weight: 0.01 lb; Diameter: 5.3 mm; Mount: Through Hole; Package Quantity: 500; Packaging: Bulk; Min Operating Temperature: -65 degC; ComponentLink1Description: Manufacturer URL; Height: 0.25 inch; ComponentLink1URL: http://www.keyelco.com/; ComponentLink2Description: Datasheet; Width: 0.25 inch; REACH SVHC: No SVHC; RoHSCompliant: true; Radiation Hardening: No; Length: 9.5 mm; DatasheetVersion: Jun-15

## Sheet Perifericos.SchDoc
size A4; SheetNumber: 6; SheetTotal: 6
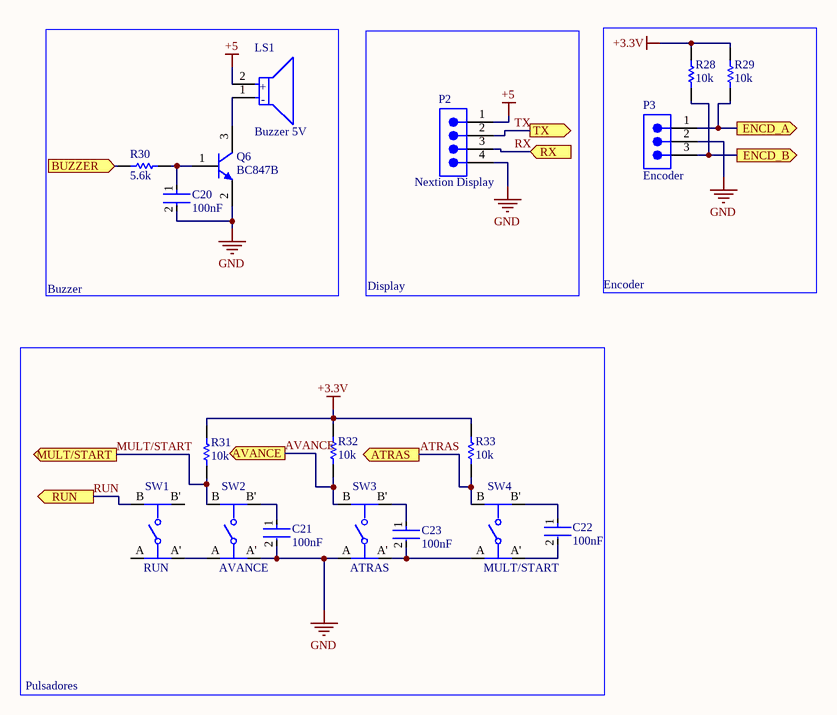
[diagram p5: Perifericos.SchDoc]

### Parts
C20  100nF  [FP-0805-L_2_01_0_2-W_1_25-IPC_B]
C21  100nF  [FP-0805-L_2_01_0_2-W_1_25-IPC_B]
C22  100nF  [FP-0805-L_2_01_0_2-W_1_25-IPC_B]
C23  100nF  [FP-0805-L_2_01_0_2-W_1_25-IPC_B]
LS1  Buzzer 5V  [FP-SDC1610M5-01-MFG]
P2  Nextion Display  [61300411121]
P3  Encoder  [61300311121]
Q6  BC847B  [INF-SOT23_M]
R28  10k  [RESC2013X50X30LL20T20]
R29  10k  [RESC2013X50X30LL20T20]
R30  5.6k  [RESC2013X50X30NL20T20]
R31  10k  [RESC2013X50X30LL20T20]
R32  10k  [RESC2013X50X30LL20T20]
R33  10k  [RESC2013X50X30LL20T20]
SW1  RUN  [FP-EVQ-PAC07K-MFG]
SW2  AVANCE  [FP-EVQ-PAC07K-MFG]
SW3  ATRAS  [FP-EVQ-PAC07K-MFG]
SW4  MULT/START  [FP-EVQ-PAC07K-MFG]

### Blocks framed on the sheet
Buzzer: C20 LS1 Q6 R30
Display: P2
Encoder: P3 R28 R29
Pulsadores: C21-C23 R31-R33 SW1-SW4

### Ports
ATRAS (out), AVANCE (out), BUZZER (in), ENCD_A (out), ENCD_B (out), MULT/START (out), RUN (out), RX (in), TX (out)

### Nets
+3.3V: R28.2 R29.2 R31.2 R32.2 R33.2
+5: LS1.2(A) P2.1
GND: C20.2 C21.2 P2.4 P3.2 Q6.2(E) SW2.A' SW3.A
ATRAS: R33.1 SW4.B ; port ATRAS
AVANCE: R32.1 SW3.B ; port AVANCE
MULT/START: R31.1 SW2.B ; port MULT/START
RUN: SW1.B ; port RUN
RX: P2.3 ; port RX
TX: P2.2 ; port TX
NetC20_1: C20.1 Q6.1(B) R30.2
NetC21_1: C21.1 SW2.B'
NetC22_1: C22.1 SW4.B'
NetC22_2: C22.2 SW4.A'
NetC23_1: C23.1 SW3.B'
NetC23_2: C23.2 SW3.A' SW4.A
NetLS1_1: LS1.1(C) Q6.3(C)
NetP3_1: P3.1 R29.1 ; port ENCD_A
NetP3_3: P3.3 R28.1 ; port ENCD_B
NetR30_1: R30.1 ; port BUZZER
NetSW1_A': SW1.A' SW2.A

Not connected (* = marked no-connect by the designer): SW1 A B'

### Notes on the sheet
- (in symbol CMP-08413-000008-1) +; -

### Library data of the parts
C20-C23 = CMP-2007-04174-2: as C7 on sheet Control; Packaging: Tape and Reel; Min Operating Temperature: -55°C; Dielectric Material: Ceramic; Height: 1.4mm; Voltage Rating: 100V; Termination: SMD/SMT; Case Code (Imperial): 0805; Case Code (Metric): 2012; Case/Package: 0805; Construction: Flat; Radiation Hardening: No; Series: -; Dielectric: X7R; Package Quantity: 2000; Mount: Surface Mount; Capacitance: 100nF; Contact Plating: Tin; Voltage: 100V; Lead Free: Lead Free; Depth: 1.25mm; RoHS Compliant: Yes; Number of Pins: 2; Max Operating Temperature: 125°C; Length: 2.01mm; Voltage Rating (DC): 100V; Thickness: 0.055inch; REACH SVHC: No SVHC; Width: 0.049inch; Tolerance: 10%
LS1 = CMP-08413-000008-1: AUDIO MAGNETIC INDICATOR 4-8V TH; Input Type: DC; Max Supply Current: 30mA; Number of Terminals/Pins: 2; Frequency: 2.4kHz; Nominal Supply Voltage (DC): 5V; Lead Free: Lead Free; Operating Supply Current: 30mA; Sensing Method: Magnetic; Termination: PC Pins; Number of Pins: 2; Mount: Through Hole; Min Operating Temperature: -10°C; Diameter: 16mm; Series: SDC; Max Operating Temperature: 70°C; Packaging: Tray; Voltage Rating: 5V; Height: 10mm
P2 = CMP-1502-01064-3: NexarPartId: 32855522; Operating Supply Voltage: 250V; Pitch: 2.54mm; Contact Resistance: 20mΩ; Number of Positions: 4; Current Rating: 3A; Connector Type: Male Pin; Gender: Male; Contact Plating: Gold; Height: 8.89mm; Lead Pitch: 2.54mm; Lead Free: Lead Free; Contact Mating Length: 5.9944mm; Number of Rows: 1; Termination: Solder; Packaging: Bulk; REACH SVHC: Unknown; Min Operating Temperature: -40°C; RoHS: Compliant; Number of Contacts: 4; Voltage Rating: 250V; Color: Black; Max Operating Temperature: 105°C; Contact Material: Copper; Mount: Through Hole; Orientation: Vertical; Number of Pins: 4
P3 = CMP-1502-01062-3: as P1 on sheet Control; REACH SVHC: Unknown; Packaging: Bulk; Contact Material: Copper; Min Operating Temperature: -40°C; Number of Rows: 1; Orientation: Vertical; RoHS: Compliant; Contact Plating: Gold; Max Operating Temperature: 105°C; Mount: Through Hole; Height: 8.94mm; Operating Supply Voltage: 250V; Number of Pins: 3; Contact Mating Length: 5.9944mm; Number of Contacts: 3; Color: Black; Lead Free: Lead Free; Lead Pitch: 2.54mm; Termination: Solder
Q6 = CMP-1177-00042-1: as Q2 on sheet Salida; PackageDescription: 3-Pin Small Outline Transistor Package, 1.3 x 2.9 mm Body, 0.95 mm Pitch; ComponentLink3URL: http://www.infineon.com/dgdl/SOT23-Package_Overview.pdf?folderId=db3a30431936bc4b0119532290053c66&fileId=db3a30431936bc4b0119533468123c85; PackageVersion: Apr-08; Packing: Reel; ComponentLink3Description: Package Specification; ComponentLink2URL: http://www.infineon.com/dgdl/bc847series_bc848series_bc849series_bc850series.pdf?folderId=db3a304314dca389011541d30fa21656&fileId=db3a304314dca389011541d4630a1657; ComponentLink1URL: http://www.infineon.com/; ComponentLink2Description: Datasheet; Polarity: NPN; Mounting Technology: Surface Mount; PackageReference: SOT23; ICM (max): 200Â mA; ComponentLink1Description: Manufacturer URL; PartNumber: BC847B
R28-R33 = CMP-2001-04896-1: as R1 on sheet Control
SW1-SW4 = CMP-00287-39841884-1: EVQ-PAC07K Switch Tactile N.O. SPST Round Button PC Pins 0.02A 15VDC 1N Thru-Hole Bulk; Max Current Rating: 20mA; Mechanical Life: 100kcycles; Contact Resistance: 50mΩ; Number of Positions: 2; Voltage Rating (DC): 15V; Actuator Length: 3.1mm; Illumination Type: Illuminated, Non-Illuminated; Switch Travel: 250µm; Switch Function: Off-Mom; Contact Plating: Gold, Silver; Max Operating Temperature: 70°C; Depth: 7.8mm; Min Operating Temperature: -20°C; Length: 6mm; Radiation Hardening: No; Mount: Through Hole; Operating Force: 1N; Height: 7mm; REACH SVHC: Unknown; Lead Free: Lead Free; Current Rating: 20mA; RoHS: Compliant; Contact Current Rating: 20mA; Width: 6mm; NexarPartId: 39841884; Electrical Life: 100kcycles; Termination: PC Pins; Packaging: Bulk; Life (Cycles): 100kcycles; Max Voltage Rating (DC): 15V; Orientation: Straight; Throw Configuration: SPST; Color: Black

## Nets that join several sheets
+3.3V: Alimentacion (U1.2), Control (U6.3V3_EN), Perifericos (5 pins)
+5: Alimentacion (C1.2 C2.2 J1.1 U1.3), Control (U2.8), Perifericos (LS1.2 P2.1)
+15: Alimentacion (C3.2 C4.2 J2.1), Control (6 pins), Salida (D1.1 Q1.1)
-15: Alimentacion (C5.1 C6.1 J2.3), Control (6 pins), Salida (D2.2 Q5.1)
GND: Alimentacion (9 pins), Control (17 pins), 2-R2 Dac (R48.1), Salida (C19.2 J3.2), Perifericos (7 pins)
ATRAS: Control (U6.GP6), Perifericos (R33.1 SW4.B)
AVANCE: Control (U6.GP7), Perifericos (R32.1 SW3.B)
GPIO8: Control (U6.GP8), 2-R2 Dac (R49.1)
GPIO9: Control (U6.GP9), 2-R2 Dac (R41.1)
GPIO10: Control (U6.GP10), 2-R2 Dac (R42.1)
GPIO11: Control (U6.GP11), 2-R2 Dac (R43.1)
GPIO12: Control (U6.GP12), 2-R2 Dac (R44.1)
GPIO13: Control (U6.GP13), 2-R2 Dac (R45.1)
GPIO14: Control (U6.GP14), 2-R2 Dac (R46.1)
GPIO15: Control (U6.GP15), 2-R2 Dac (R47.1)
MULT/START: Control (U6.GP3), Perifericos (R31.1 SW2.B)
NetC18_1: Control (P1.3), Salida (7 pins)
NetP1_1: Control (P1.1 U3.7), Salida (R27.1)
NetP3_1: Control (U6.GP4), Perifericos (P3.1 R29.1)
NetP3_3: Control (U6.GP5), Perifericos (P3.3 R28.1)
NetR19_2: Control (U6.GP21), Salida (R19.2)
NetR20_2: Control (U6.GP20), Salida (R20.2)
NetR30_1: Control (U6.GP22), Perifericos (R30.1)
RUN: Control (U6.RUN), Perifericos (SW1.B)
RX: Control (U6.GP1), Perifericos (P2.3)
Salida_Dac: Control (R1.1 TP1.1), 2-R2 Dac (R40.2 R47.2)
TX: Control (U6.GP0), Perifericos (P2.2)